# Altium schematic sheet outputs.SchDoc
size A4; SheetNumber: 4; SheetTotal: 8
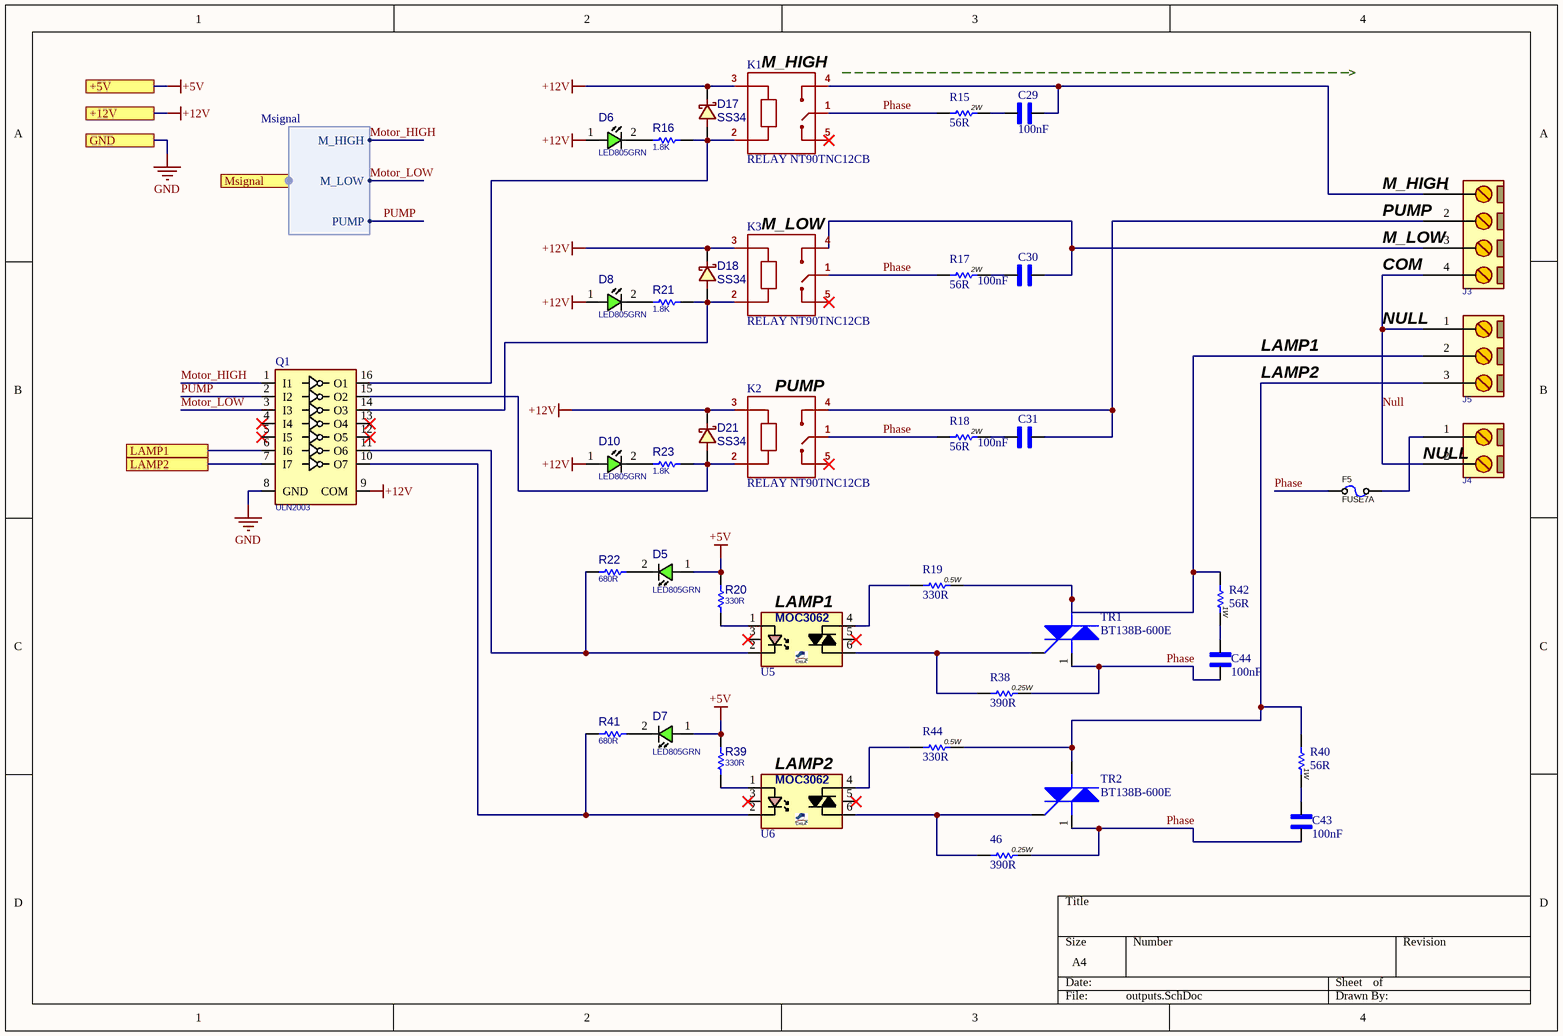
[diagram p0: outputs.SchDoc]

## Parts
46  390R  [Res THD 0.25w]
C29  100nF  [Capacitor Film]
C30  100nF  [Capacitor Film]
C31  100nF  [Capacitor Film]
C43  100nF  [Capacitor Film]
C44  100nF  [Capacitor Film]
D5  LED805GRN  [LED0805GRN]
D6  LED805GRN  [LED0805GRN]
D7  LED805GRN  [LED0805GRN]
D8  LED805GRN  [LED0805GRN]
D10  LED805GRN  [LED0805GRN]
D17  SS34  [D_SMB]
D18  SS34  [D_SMB]
D21  SS34  [D_SMB]
F5  FUSE7A  [FUSH_5X20MM]
J3  CONN_GMSTB4  [GMSTB762_4]  (value not drawn)
J4  CONN_GMSTB2  [GMSTB762_2]  (value not drawn)
J5  CONN_GMSTB3  [GMSTB762_3]  (value not drawn)
K1  RELAY NT90TNC12CB  [RELAY NT90TNC12CB]
K2  RELAY NT90TNC12CB  [RELAY NT90TNC12CB]
K3  RELAY NT90TNC12CB  [RELAY NT90TNC12CB]
Q1  ULN2003  [SO_16]
R15  56R  [Res THD 2w]
R16  1.8K  [R0805]
R17  56R  [Res THD 2w]
R18  56R  [Res THD 2w]
R19  330R  [Res THD 0.5w]
R20  330R  [R0805]
R21  1.8K  [R0805]
R22  680R  [R0805]
R23  1.8K  [R0805]
R38  390R  [Res THD 0.25w]
R39  330R  [R0805]
R40  56R  [Res THD 1w]
R41  680R  [R0805]
R42  56R  [Res THD 1w]
R44  330R  [Res THD 0.5w]
TR1  BT138B-600E  [BT138B-600E]
TR2  BT138B-600E  [BT138B-600E]
U5  MOC3062  [DIP_6SMD]  (value not drawn)
U6  MOC3062  [DIP_6SMD]  (value not drawn)

## Ports
+5V, +12V, GND, LAMP1, LAMP2, Msignal (harness Msignal)

## Harnesses
Msignal: M_HIGH, M_LOW, PUMP

## Nets
+5V: D5.1(ANODE) D7.1(ANODE) R20.1 R39.1 ; port +5V
+12V: D6.1(ANODE) D8.1(ANODE) D10.1(ANODE) D17.2 D18.2 D21.2 K1.3(A) K2.3(A) K3.3(A) Q1.9(COM) ; port +12V
GND: Q1.8(GND) ; port GND
LAMP1: Q1.6(I6) ; port LAMP1
LAMP2: Q1.7(I7) ; port LAMP2
Motor_HIGH: Q1.1(I1) ; port Msignal.M_HIGH
Motor_LOW: Q1.3(I3) ; port Msignal.M_LOW
Null: J3.4 J4.2 J5.1
Phase: 46.2 C43.2 C44.2 F5.1 K1.1(COM) K2.1(COM) K3.1(COM) R15.1 R17.1 R18.1 R38.2 TR1.1(T1) TR2.1(T1)
PUMP: Q1.2(I2) ; port Msignal.PUMP
Net46_1: 46.1 TR2.3(G) U6.6(A/K)
NetC29_1: C29.1 R15.2
NetC29_2: C29.2 J3.1 K1.4(N.O)
NetC30_1: C30.1 R17.2
NetC30_2: C30.2 J3.3 K3.4(N.O)
NetC31_1: C31.1 R18.2
NetC31_2: C31.2 J3.2 K2.4(N.O)
NetC43_1: C43.1 R40.2
NetC44_1: C44.1 R42.2
NetD5_2: D5.2(CATHODE) R22.1
NetD6_2: D6.2(CATHODE) R16.1
NetD7_2: D7.2(CATHODE) R41.1
NetD8_2: D8.2(CATHODE) R21.1
NetD10_2: D10.2(CATHODE) R23.1
NetD17_1: D17.1 K1.2(A) Q1.16(O1) R16.2
NetD18_1: D18.1 K3.2(A) Q1.14(O3) R21.2
NetD21_1: D21.1 K2.2(A) Q1.15(O2) R23.2
NetF5_2: F5.2 J4.1
NetJ5_2: J5.2 R19.2 R42.1 TR1.2_4(T2)
NetJ5_3: J5.3 R40.1 R44.2 TR2.2_4(T2)
NetQ1_10: Q1.10(O7) R41.2 U6.2(K)
NetQ1_11: Q1.11(O6) R22.2 U5.2(K)
NetR19_1: R19.1 U5.4(A/K)
NetR20_2: R20.2 U5.1(A)
NetR38_1: R38.1 TR1.3(G) U5.6(A/K)
NetR39_2: R39.2 U6.1(A)
NetR44_1: R44.1 U6.4(A/K)

Not connected (* = marked no-connect by the designer): K1 5(N.C)*; K2 5(N.C)*; K3 5(N.C)*; Q1 4(I4)* 5(I5)* 12(O5)* 13(O4)*; U5 3(NC)* 5(NC)*; U6 3(NC)* 5(NC)*

## Notes on the sheet
- (near K1) M_HIGH
- (near K3) M_LOW
- (near J3) PUMP
- (near J3) M_HIGH
- (near J3) M_LOW
- COM
- LAMP2
- LAMP1
- NULL
- (near K2) PUMP
- (near J4) NULL
- (near U5) LAMP1
- (near U6) LAMP2
- (in symbol Res THD 0.5w) 0.5W
- (in symbol Res THD 0.25w) 0.25W

## Library data of the parts
46 R38 = Res THD 0.25w: Resistor 1/4W; Rating: 0.25w; Value: 390R; Type: 10%; Package: THD
C29-C31 C43 C44 = Capacitor Film: Capacitor Film Pitch=10mm
D5-D8 D10 = LED_SMD_0805_GRN: LED, SMD, 0805, GREEN; PARAM: 20mA; DESC: DESCRIPTION; PARAM2: 2.2V; MANF: -; ASSEMBLY: ASSEMBLY; PRICE: 36t@Javan; MANF_P#: -; VALUE: LED805GRN
D17 D18 D21 = DIODE_SMD_SCHOTTKY_SS34: DIODE, SCHOTTKY, 20V, 3A; MANF: VISHAY; DESC: DESCRIPTION; MANF_P#: SS34; ASSEMBLY: ASSEMBLY; PRICE: PRICE; PARAM2: 3A; PARAM: 20V; VALUE: SS34
F5 = FUSE_5X20: Fuse HOLDER 5X20; PARAM: 2A; MANF_P#: MANF_PART#; MANF: MANF; PARAM2: PARAM2; VALUE: FUSE7A
J3 = CONN_GMSTB762_4: CONN, PHOENIX MSTB, 5-G, 5.08mm pitch; MANF_P#: GMSTB 2,5/4-G-7,62; VALUE: CONN_GMSTB4
J4 = CONN_GMSTB762_2: CONN, PHOENIX GMSTB, 7.62mm pitch; MANF_P#: GMSTB 2,5/2-G-7,62; VALUE: CONN_GMSTB2
J5 = CONN_GMSTB762_3: CONN, PHOENIX MSTB, 5-G, 5.08mm pitch; MANF_P#: GMSTB 2,5/3-G-7,62; VALUE: CONN_GMSTB3
K1-K3 = RELAY NT90TNC12CB: Relay SPDT POWER NEEDLE; Value: RELAY NT90TNC12CB; Library Link: https://github.com/Majid-Derhambakhsh; Publisher: Majid Derhambakhsh
Q1 = ULN2003_SOP16_ST: Darlington, 7-CH, 50V, 0.5A, 5V TTL/CMOS; MANF_P#: ULN2003D1; MANF: ST; PARAM: 7-CH, 50V, 0.5A; PARAM2: 5V TTL/CMOS; VALUE: ULN2003
R15 R17 R18 = Res THD 2w: Resistor 2W; Value: 56R; Rating: 2W; Type: 10%; Package: THD
R16 R20-R23 R39 R41 = RES_SMD_0805: RESISTOR, SMD; PARAM: -W; DESC: DESCRIPTION; DIST#: MOUSER; PARAM2: 1%; MANF_P#: -; MANF: -; ASSEMBLY: ASSEMBLY; PRICE: 100= 0.5$
  R16 R21 R23: VALUE: 1.8K
  R20 R39: VALUE: 330R
  R22 R41: VALUE: 680R
R19 R44 = Res THD 0.5w: Resistor 1/2W; Rating: 0.5w; Value: 330R; Type: 10%; Package: THD
R40 R42 = Res THD 1w: Resistor 1W; Value: 56R; Rating: 1W; Type: 10%; Package: THD
TR1 TR2 = BT138B-600E: Triac 600V, 12A
U5 U6 = OPT_TRIAC6P_MOC3062SMD: OPTOTRIAC, 600v/1A, 6v In; PARAM2: 300mW, -40~85°C; PARAM: 6v/60mA IN/ 600v/1A out, 10mA LED; MANF_P#: MOC3062; PRICE: 7t@paya; VALUE: MOC3062